# EAGLE schematic LIDAR_Breakout (EAGLE 9.3.0)
AUTHORS: Austin Keener, Peter Wilson, Johannes Kunz, Mukund Pandiri; REVISION: 1.1; SCH_DESC: Ethernet Breakout Board for Lidar Lite 3 Modules; TEAM: RoboRacing; TITLE: Lidar_Breakout
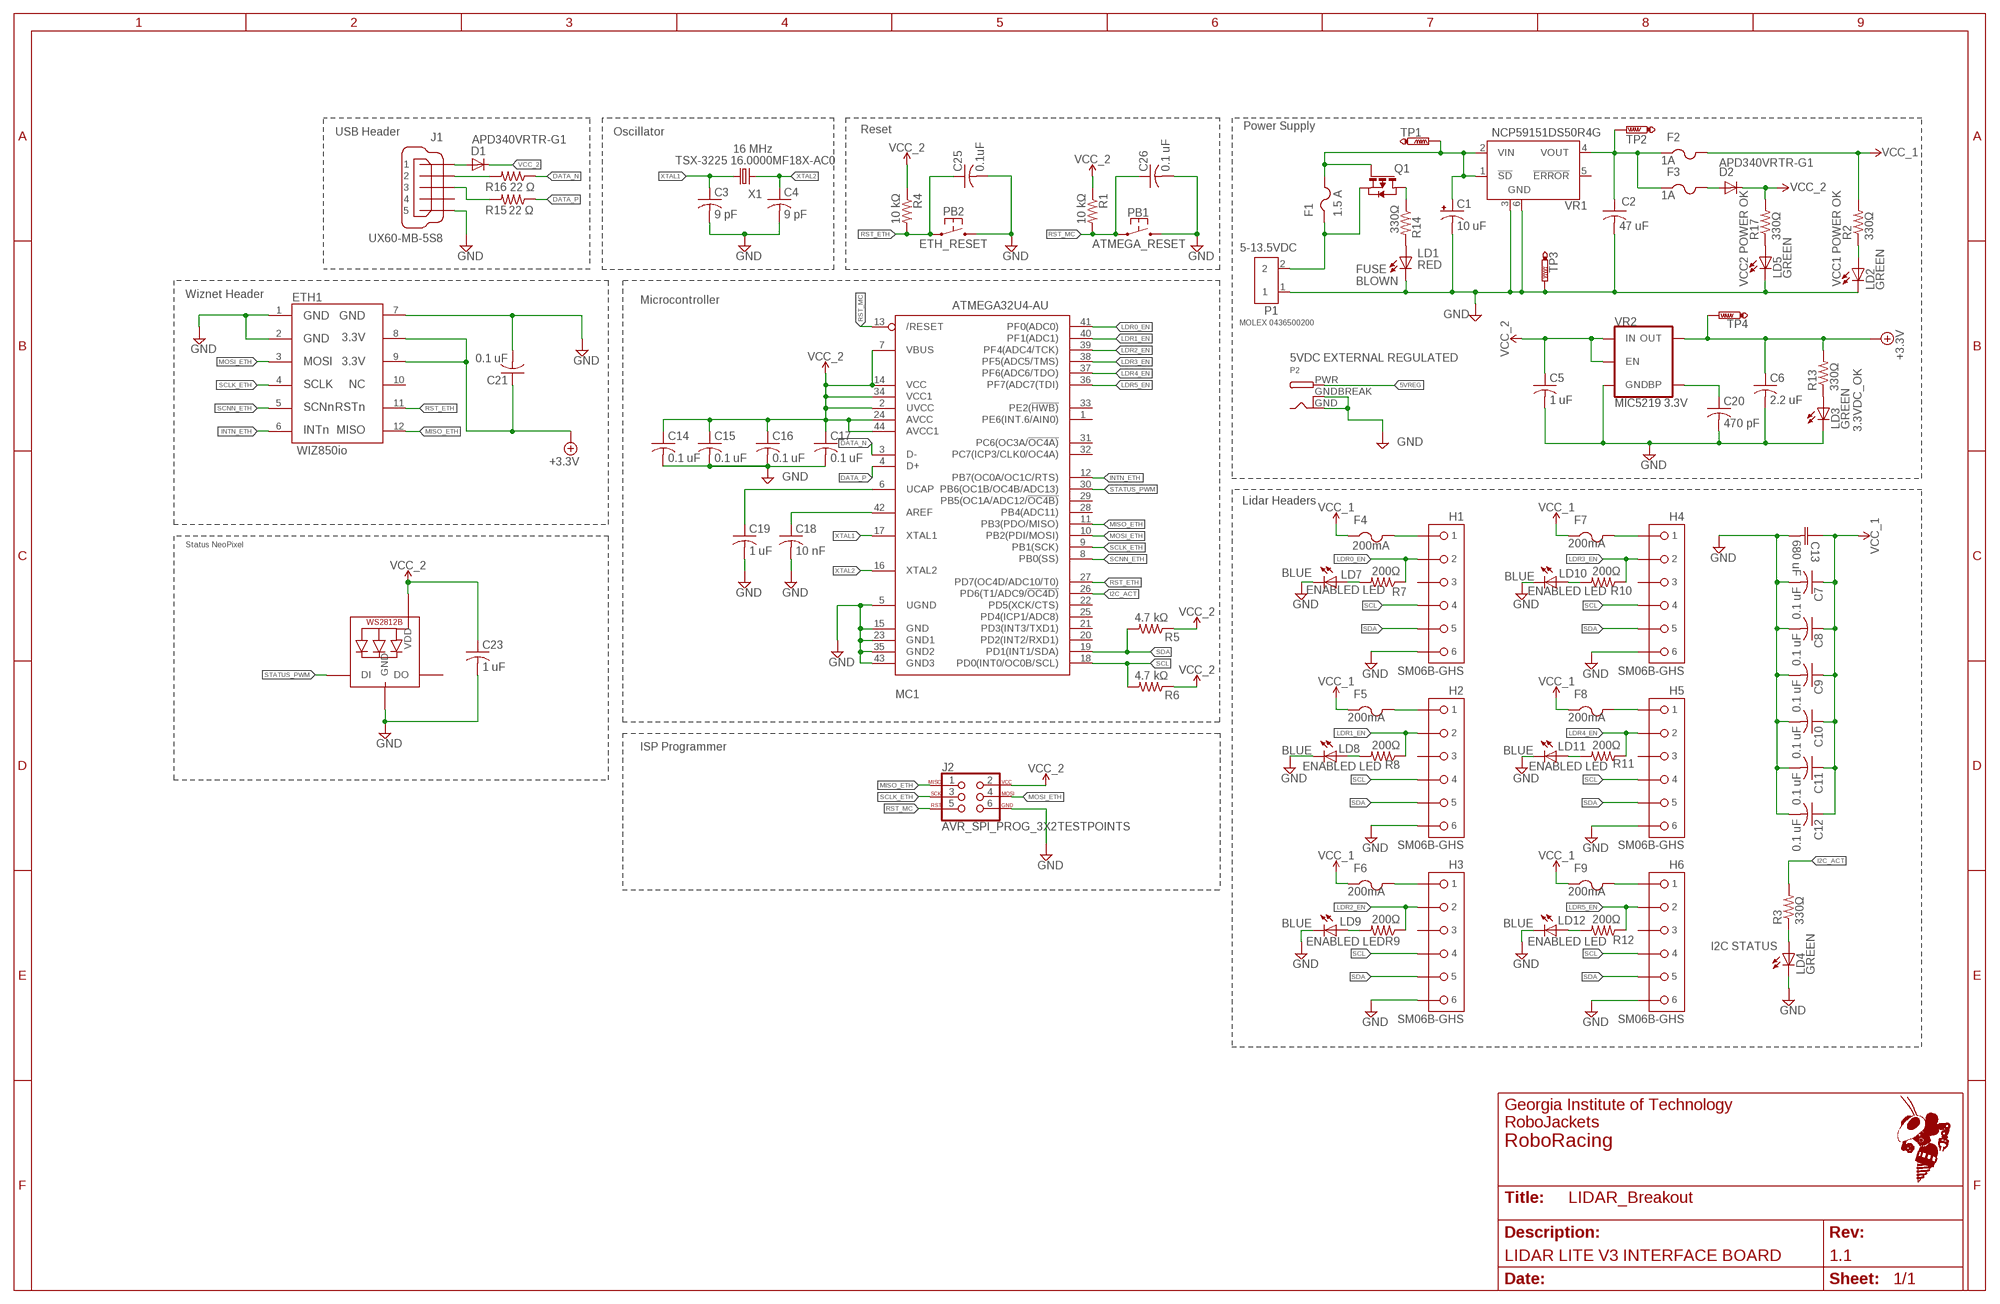
[diagram p0: schematic, sheet 1]
FRAME1 (FRAME_B_L): SCH_DESC: LIDAR LITE V3 INTERFACE BOARD

## Parts
C1  10 uF  CPOL-USE2-5  [E2-5]
C2  47 uF  C-USC0805  [C0805]
C3  9 pF  C-USC0603  [C0603]
C4  9 pF  C-USC0603  [C0603]
C5  1 uF  C-USC0603  [C0603]
C6  2.2 uF  C-USC0603  [C0603]
C7  0.1 uF  C-USC0603  [C0603]
C8  0.1 uF  C-USC0603  [C0603]
C9  0.1 uF  C-USC0603  [C0603]
C10  0.1 uF  C-USC0603  [C0603]
C11  0.1 uF  C-USC0603  [C0603]
C12  0.1 uF  C-USC0603  [C0603]
C13  680 uF  EEE-FTJ681XAP  [CAP_PAN_EEE_D8]
C14  0.1 uF  C-USC0603  [C0603]
C15  0.1 uF  C-USC0603  [C0603]
C16  0.1 uF  C-USC0603  [C0603]
C17  0.1 uF  C-USC0603  [C0603]
C18  10 nF  C-USC0603  [C0603]
C19  1 uF  C-USC0603  [C0603]
C20  470 pF  C-USC0603  [C0603]
C21  0.1 uF  C-USC0603  [C0603]
C23  1 uF  C-USC0603  [C0603]
C25  0.1uF  C-USC0603  [C0603]
C26  0.1 uF  C-USC0603  [C0603]
D1  APD340VRTR-G1  DIODE-DO-214AC  [DO-214AC]
D2  APD340VRTR-G1  DIODE-DO-214AC  [DO-214AC]
ETH1  WIZ850IO  [WIZ850IO]
F1  1.5 A  PTCFUSE-1812  [1812]
F2  1A  PTCFUSE-1206  [R1206]
F3  1A  PTCFUSE-1206  [R1206]
F4  200mA  PTCFUSE-1206  [R1206]
F5  200mA  PTCFUSE-1206  [R1206]
F6  200mA  PTCFUSE-1206  [R1206]
F7  200mA  PTCFUSE-1206  [R1206]
F8  200mA  PTCFUSE-1206  [R1206]
F9  200mA  PTCFUSE-1206  [R1206]
H1  SM06B-GHS  [SM06B-GHS]
H2  SM06B-GHS  [SM06B-GHS]
H3  SM06B-GHS  [SM06B-GHS]
H4  SM06B-GHS  [SM06B-GHS]
H5  SM06B-GHS  [SM06B-GHS]
H6  SM06B-GHS  [SM06B-GHS]
J1  UX60-MB-5S8  [UX60-MB-5S8]
J2  AVR_SPI_PROG_3X2TESTPOINTS  [2X3_TEST_POINTS]
LD1  RED  LED-SMD-RED  [CHIP-LED0603]
LD2  GREEN  LEDCHIP-LED0603  [CHIP-LED0603]
LD3  GREEN  LEDCHIP-LED0603  [CHIP-LED0603]
LD4  GREEN  LEDCHIP-LED0603  [CHIP-LED0603]
LD5  GREEN  LEDCHIP-LED0603  [CHIP-LED0603]
LD6  WS2812B5050  [WS2812B]
LD7  BLUE  LEDCHIP-LED0603  [CHIP-LED0603]
LD8  BLUE  LEDCHIP-LED0603  [CHIP-LED0603]
LD9  BLUE  LEDCHIP-LED0603  [CHIP-LED0603]
LD10  BLUE  LEDCHIP-LED0603  [CHIP-LED0603]
LD11  BLUE  LEDCHIP-LED0603  [CHIP-LED0603]
LD12  BLUE  LEDCHIP-LED0603  [CHIP-LED0603]
MC1  ATMEGA32U4-AU  [TQFP44]
P1  MOLEX 0436500200  0436500200  [MOLEX_0436500200]
P2  DCBARRELPTH  [DCJACK_2MM_PTH]
PB1  ATMEGA_RESET  PB_RA  [TACT_PB_RA]
PB2  ETH_RESET  RESET_PB_RA  [RESET_PB_RA]
Q1  PMOS  [SOT-23-3]
R1  10 kΩ  R-US_R0603  [R0603]
R2  330Ω  R-US_R0603  [R0603]
R3  330Ω  R-US_R0603  [R0603]
R4  10 kΩ  R-US_R0603  [R0603]
R5  4.7 kΩ  R-US_R0603  [R0603]
R6  4.7 kΩ  R-US_R0603  [R0603]
R7  200Ω  R-US_R0603  [R0603]
R8  200Ω  R-US_R0603  [R0603]
R9  200Ω  R-US_R0603  [R0603]
R10  200Ω  R-US_R0603  [R0603]
R11  200Ω  R-US_R0603  [R0603]
R12  200Ω  R-US_R0603  [R0603]
R13  330Ω  R-US_R0603  [R0603]
R14  330Ω  R-US_R0603  [R0603]
R15  22 Ω  R-US_R0603  [R0603]
R16  22 Ω  R-US_R0603  [R0603]
R17  330Ω  R-US_R0603  [R0603]
TP1  PTR1B1,27  [B1,27]
TP2  PTR1B1,27  [B1,27]
TP3  PTR1PAD1-13  [P1-13]
TP4  PTR1B1,27  [B1,27]
VR1  NCP59151DS50R4G  LP3963ES-5.0  [TO263-5]
VR2  MIC5219 3.3V  V_REG_MIC52193.3V  [SOT23-5]
X1  TSX-3225 16.0000MF18X-AC0  XTAL-3.2X2.5  [XTAL-3.2X2.5]

## Nets
5VREG: C2.1 F2.1 F3.1 P2.PWR TP2.TP VR1.4(VOUT)
+3.3V: C6.1 C21.1 ETH1.8 ETH1.9 R13.2 TP4.TP VR2.5(OUT)
AREF: C18.1 MC1.42(AREF)
DATA_N [diff]: MC1.3(D-) R16.1
DATA_P [diff]: MC1.4(D+) R15.1
GND: C1.- C2.2 C3.2 C4.2 C5.2 C6.2 C7.2 C8.2 C9.2 C10.2 C11.2 C12.2 C13.2 C14.2 C15.2 C16.2 C17.2 C18.2 C19.2 C20.2 C21.2 C23.2 C25.2 C26.2 ETH1.1 ETH1.2 ETH1.7 H1.P$8 H2.P$8 H3.P$8 H4.P$8 H5.P$8 H6.P$8 J1.5 J2.6 LD1.C(K) LD2.C LD3.C LD4.C LD5.C LD6.3-GND(GND) LD7.C LD8.C LD9.C LD10.C LD11.C LD12.C MC1.5(UGND) MC1.15(GND) MC1.23(GND1) MC1.35(GND2) MC1.43(GND3) P1.1 P2.GND P2.GNDBREAK PB1.P$2 PB2.P$3 TP3.TP VR1.3(GND) VR1.6(GND) VR2.2(GND)
I2C_ACT: MC1.26(PD6(T1/ADC9/!OC4D)) R3.2
INTN_ETH: ETH1.6 MC1.12(PB7(OC0A/OC1C/RTS))
LDR0_EN: H1.P$4 MC1.41(PF0(ADC0)) R7.1
LDR0_LED: LD7.A R7.2
LDR1_EN: H2.P$4 MC1.40(PF1(ADC1)) R8.1
LDR1_LED: LD8.A R8.2
LDR2_EN: H3.P$4 MC1.39(PF4(ADC4/TCK)) R9.1
LDR2_LED: LD9.A R9.2
LDR3_EN: H4.P$4 MC1.38(PF5(ADC5/TMS)) R10.1
LDR3_LED: LD10.A R10.2
LDR4_EN: H5.P$4 MC1.37(PF6(ADC6/TDO)) R11.1
LDR4_LED: LD11.A R11.2
LDR5_EN: H6.P$4 MC1.36(PF7(ADC7(TDI)) R12.1
LDR5_LED: LD12.A R12.2
MISO_ETH: ETH1.12 J2.1 MC1.11(PB3(PDO/MISO))
MOSI_ETH: ETH1.3 J2.4 MC1.10(PB2(PDI/MOSI))
N$1: D1.A J1.1
N$2: LD4.A R3.1
N$3: LD2.A R2.1
N$4: Q1.3(D) R14.1
N$5: LD3.A R13.1
N$6: LD1.A R14.2
N$7: D2.A F3.2
N$8: J1.2 R16.2
N$9: LD5.A R17.1
N$23: J1.3 R15.2
N$31: C20.1 VR2.4(BP)
RST_ETH: C25.1 ETH1.11 MC1.27(PD7(OC4D/ADC10/T0)) PB2.P$1 R4.2
RST_MC: C26.1 J2.5 MC1.13(/RESET) PB1.P$1 R1.2
SCL: H1.P$6 H2.P$6 H3.P$6 H4.P$6 H5.P$6 H6.P$6 MC1.18(PD0(INT0/OC0B/SCL)) R6.2
SCLK_ETH: ETH1.4 J2.3 MC1.9(PB1(SCK))
SCNN_ETH: ETH1.5 MC1.8(PB0(SS))
SDA: H1.P$7 H2.P$7 H3.P$7 H4.P$7 H5.P$7 H6.P$7 MC1.19(PD1(INT1/SDA)) R5.2
STATUS_PWM: LD6.4-DIN(DI) MC1.30(PB6(OC1B/OC4B/ADC13))
UCAP: C19.1 MC1.6(UCAP)
UVCC: F1.1 P1.2 Q1.2(S)
VCC_1: C7.1 C8.1 C9.1 C10.1 C11.1 C12.1 C13.1 F2.2 F4.1 F5.1 F6.1 F7.1 F8.1 F9.1 R2.2
VCC_2: C5.1 C14.1 C15.1 C16.1 C17.1 C23.1 D1.C D2.C J2.2 LD6.1-VDD(VDD) MC1.2(UVCC) MC1.7(VBUS) MC1.14(VCC) MC1.24(AVCC) MC1.34(VCC1) MC1.44(AVCC1) R1.1 R4.1 R5.1 R6.1 R17.2 VR2.1(IN) VR2.3(EN)
VCC_LDR0: F4.2 H1.P$3
VCC_LDR1: F5.2 H2.P$3
VCC_LDR2: F6.2 H3.P$3
VCC_LDR3: F7.2 H4.P$3
VCC_LDR4: F8.2 H5.P$3
VCC_LDR5: F9.2 H6.P$3
VIN: C1.+ F1.2 Q1.1(G) TP1.TP VR1.1(!SD) VR1.2(VIN)
XTAL1: C3.1 MC1.17(XTAL1) X1.1
XTAL2: C4.1 MC1.16(XTAL2) X1.3
Unconnected: ETH1.10 H1.P$5 H2.P$5 H3.P$5 H4.P$5 H5.P$5 H6.P$5 J1.4 LD6.2-DOUT(DO) MC1.1(PE6(INT.6/AIN0)) MC1.20(PD2(INT2/RXD1)) MC1.21(PD3(INT3/TXD1)) MC1.22(PD5(XCK/CTS)) MC1.25(PD4(ICP1/ADC8)) MC1.28(PB4(ADC11)) MC1.29(PB5(OC1A/ADC12/!OC4B)) MC1.31(PC6(OC3A/!OC4A)) MC1.32(PC7(ICP3/CLK0/OC4A)) MC1.33(PE2(!HWB)) VR1.5(!ERROR)

## Notes on the sheet
- Power Supply
- USB Header | Oscillator | Reset
- 16 MHz
- 5-13.5VDC
- FUSE
  BLOWN
- VCC2 POWER OK | VCC1 POWER OK
- Wiznet Header
- Microcontroller
- 5VDC EXTERNAL REGULATED
- 3.3VDC_OK
- Lidar Headers
- Status NeoPixel
- ENABLED LED | ENABLED LED
- ISP Programmer
- ENABLED LED | ENABLED LED
- ENABLED LED | ENABLED LED
- I2C STATUS

## Library data of the parts
C1 = rcl:CPOL-US: POLARIZED CAPACITOR, American symbol; SPICEPREFIX: C
C2 C23 = rcl:C-US: CAPACITOR, American symbol; SPICEPREFIX: C
C3-C12 C14-C21 C25 C26 = resistor:C-US: CAPACITOR, American symbol
C13 = 680uF_Elect_Cap:EEE-FTJ681XAP; MANUFACTURER_PART_NUMBER: EEEFTJ681XAP; VENDOR: Panasonic
D1 D2 = RoboJackets-Diodes:DIODE-: DIODE
ETH1 = WIZ850io:WIZ850IO
F1-F9 = adafruit:PTCFUSE: PTC fuses, resettable thermistors
H1-H6 = RoboJackets-Connectors:SM06B-GHS
J1 = RoboJackets-Connectors:UX60*-MB-5S?: Mini USB Connector Brand: Hirose Electric Co Ltd <http://www.hirose.com/us/> Series: UX <http://www.digikey.com/product-search/en?FV=fff40016,fff802e4,ffec3225> Distributor: Digi-Key <http://www.digikey.com/product-detail/en/UX60A-MB-5ST/H2961CT-ND/597540>; PINS: 5
J2 = SparkFun-Connectors:AVR_SPI_PROG_3X2: AVR ISP 6 Pin This is the reduced ISP connector for AVR programming. Common on Arduino. This footprint will take up less PCB space and can be used with a 10-pin to 6-pin adapter such as SKU: BOB-08508 **Special note about "TEST_POINT" package. The stop mask is on the top side, so if you want your programming test points to be on the bottom of your board, make sure to place this package on the bottom side of the board. This also ensure that the orientation to program from the bottom side will be correct. SparkFun Products: SparkFun ISP Pogo Adapter <https://www.sparkfun.com/products/11591> - NS Tiny AVR Programmer <https://www.sparkfun.com/products/11801> -PTH
LD1 = RoboJackets-LEDs:LED-SMD; DIGIKEY: 160-1447-1-ND; MPN: LTST-C191KRKT
LD2-LD5 LD7-LD12 = led:LED: LED OSRAM: - CHIPLED LG R971, LG N971, LY N971, LG Q971, LY Q971, LO R971, LY R971 LH N974, LH R974 LS Q976, LO Q976, LY Q976 LO Q996 - Hyper CHIPLED LW Q18S LB Q993, LB Q99A, LB R99A - SideLED LS A670, LO A670, LY A670, LG A670, LP A670 LB A673, LV A673, LT A673, LW A673 LH A674 LY A675 LS A676, LA A676, LO A676, LY A676, LW A676 LS A679, LY A679, LG A679 - Hyper Micro SIDELED® LS Y876, LA Y876, LO Y876, LY Y876 LT Y87S - SmartLED LW L88C, LW L88S LB L89C, LB L89S, LG L890 LS L89K, LO L89K, LY L89K LS L896, LA L896, LO L896, LY L896 - TOPLED LS T670, LO T670, LY T670, LG T670, LP T670 LSG T670, LSP T670, LSY T670, LOP T670, LYG T670 LG T671, LOG T671, LSG T671 LB T673, LV T673, LT T673, LW T673 LH T674 LS T676, LA T676, LO T676, LY T676, LB T676, LH T676, LSB T676, LW T676 LB T67C, LV T67C, LT T67C, LS T67K, LO T67K, LY T67K, LW E67C LS E67B, LA E67B, LO E67B, LY E67B, LB E67C, LV E67C, LT E67C LW T67C LS T679, LY T679, LG T679 LS T770, LO T770, LY T770, LG T770, LP T770 LB T773, LV T773, LT T773, LW T773 LH T774 LS E675, LA E675, LY E675, LS T675 LS T776, LA T776, LO T776, LY T776, LB T776 LHGB T686 LT T68C, LB T68C - Hyper Mini TOPLED® LB M676 - Mini TOPLED Santana® LG M470 LS M47K, LO M47K, LY M47K Source: http://www.osram.convergy.de LUXEON: - LUMILED® LXK2-PW12-R00, LXK2-PW12-S00, LXK2-PW14-U00, LXK2-PW14-V00 LXK2-PM12-R00, LXK2-PM12-S00, LXK2-PM14-U00 LXK2-PE12-Q00, LXK2-PE12-R00, LXK2-PE12-S00, LXK2-PE14-T00, LXK2-PE14-U00 LXK2-PB12-K00, LXK2-PB12-L00, LXK2-PB12-M00, LXK2-PB14-N00, LXK2-PB14-P00, LXK2-PB14-Q00 LXK2-PR12-L00, LXK2-PR12-M00, LXK2-PR14-Q00, LXK2-PR14-R00 LXK2-PD12-Q00, LXK2-PD12-R00, LXK2-PD12-S00 LXK2-PH12-R00, LXK2-PH12-S00 LXK2-PL12-P00, LXK2-PL12-Q00, LXK2-PL12-R00 Source: www.luxeon.com KINGBRIGHT: KA-3528ASYC Source: www.kingbright.com
LD6 = adafruit:WS2812B
MC1 = adafruit:ATMEGA32U4: http://www.ladyada.net/library/eagle
P1 = 0436500200:0436500200: CONN HEADER 2POS 3MM RT ANG TIN; DESCRIPTION: Conn Power HDR 2 POS 3mm Solder RA Thru-Hole 2 Terminal 1 Port Micro-Fit 3.0Ã¢âÂ¢ Tray; MF: Molex, LLC; MP: 0436500200; PACKAGE: None
P2 = adafruit:DCBARREL: 2.0mm DC Barrel Jack DCJACK_2MM_PTH - Through Hole Jack (4UConnector: 05537)
PB1 = RoboJackets-Switches:PB_RA
PB2 = RoboJackets-Switches:RESET_PB_RA
Q1 = RoboJackets-Discrete:PMOS
R1-R17 = rcl:R-US_: RESISTOR, American symbol; SPICEPREFIX: R
TP1-TP4 = testpad:PTR1: TEST PIN
VR1 = linear:LP3963?*: 3A Fast Ultra Low Dropout Linear Regulator Source: http://cache.national.com/ds/LP/LP3963.pdf
VR2 = SparkFun-IC-Power:V_REG_MIC5219: V_REG MIC5219 Standard 3.3V and 5V 500mA LDO voltage regulator in SOT-23 layout. Micrel part MIC5219. BP (by-pass) pin is used to lower output noise with 470pF cap, may be left open.; PROD_ID: VREG-09872
X1 = RoboJackets-FreqGen:XTAL

## Net classes
0 default: width 0.203 mm
2 diff: width 0.406 mm